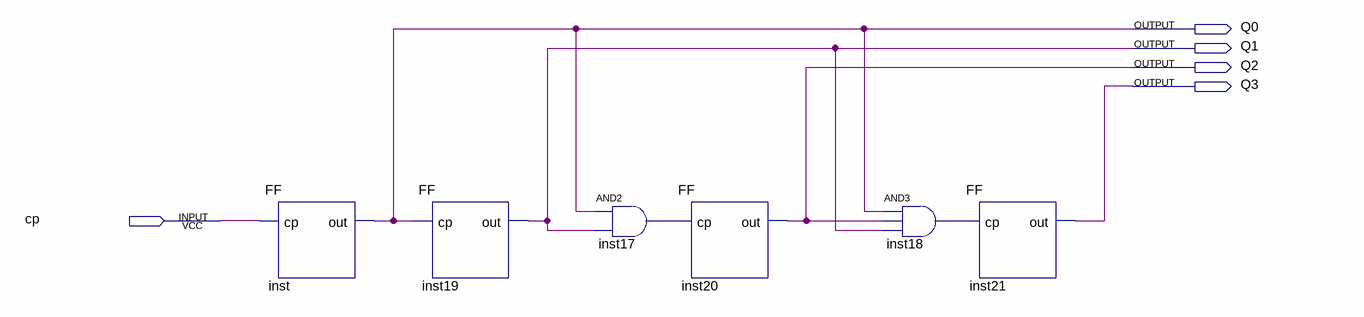
[diagram p0: schematic sheet]
// Quartus schematic 4bit_count_async.bdf as structural Verilog: 6 symbols, 5 pins
module \4bit_count_async  (
  input  cp,
  output Q0,
  output Q1,
  output Q2,
  output Q3
);

  wire inst17_out, inst18_out;

  FF inst (.cp(cp), .out(Q0));
  FF inst19 (.cp(Q0), .out(Q1));
  and inst17 (inst17_out, Q0, Q1);
  FF inst20 (.cp(inst17_out), .out(Q2));
  and inst18 (inst18_out, Q0, Q2, Q1);
  FF inst21 (.cp(inst18_out), .out(Q3));
endmodule
